# Altium schematic sheet Top.SchDoc
size A4; DocumentNumber: 11; SheetNumber: 1; SheetTotal: 14
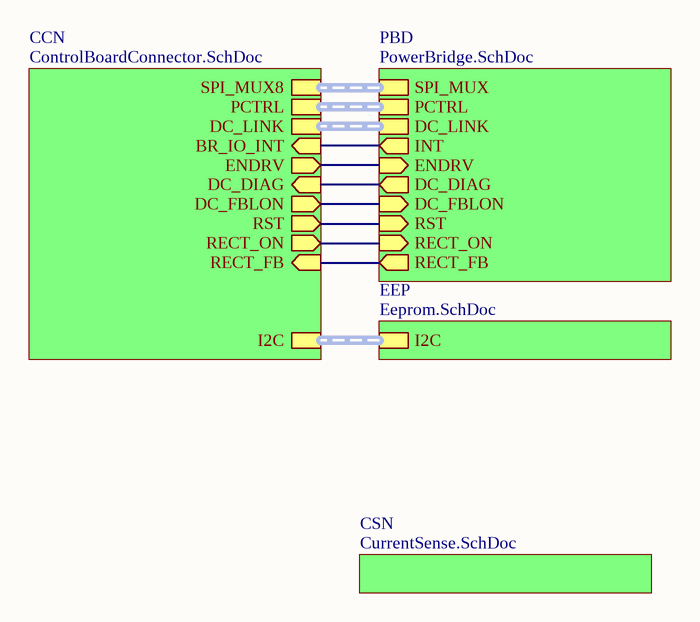
[diagram p0: Top.SchDoc]

## Sub-sheets
CCN = ControlBoardConnector.SchDoc: SPI_MUX8 (harness SPI_MUX8), PCTRL (harness PCTRL), DC_LINK (harness DC_LINK), BR_IO_INT (in), DC_FBLON (out), DC_DIAG (in), ENDRV (out), RST (out), RECT_ON (out), RECT_FB (in), I2C (harness I2C)
CSN = CurrentSense.SchDoc: no entries
EEP = Eeprom.SchDoc: I2C (harness I2C)
PBD = PowerBridge.SchDoc: SPI_MUX (harness SPI_MUX8), INT (out), PCTRL (harness PCTRL), DC_LINK (harness DC_LINK), ENDRV (in), DC_DIAG (out), DC_FBLON (in), RST (in), RECT_ON (in), RECT_FB (out)

## Nets
(unnamed): sheet CCN/BR_IO_INT, sheet PBD/INT
(unnamed): sheet CCN/DC_FBLON, sheet PBD/DC_FBLON
(unnamed): sheet CCN/DC_DIAG, sheet PBD/DC_DIAG
(unnamed): sheet CCN/ENDRV, sheet PBD/ENDRV
(unnamed): sheet CCN/RST, sheet PBD/RST
(unnamed): sheet CCN/RECT_ON, sheet PBD/RECT_ON
(unnamed): sheet CCN/RECT_FB, sheet PBD/RECT_FB

## Buses and harness runs
harness sheet CCN/DC_LINK = sheet PBD/DC_LINK
harness sheet CCN/I2C = sheet EEP/I2C
harness sheet CCN/PCTRL = sheet PBD/PCTRL
harness sheet CCN/SPI_MUX8 = sheet PBD/SPI_MUX